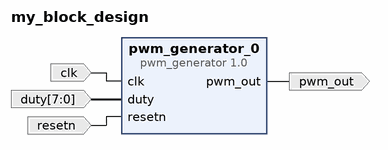
[diagram p0: block diagram of the top level]
# Vivado block design my_block_design, xc7a15tcsg324-2, Vivado 2022.2
create_bd_design my_block_design

create_bd_port -dir I -type clk clk
set_property -dict {CONFIG.FREQ_HZ 100000000} [get_bd_ports clk]
create_bd_port -dir I -type rst resetn
create_bd_port -dir I -from 7 -to 0 duty
create_bd_port -dir O pwm_out

create_bd_cell -type ip -vlnv gbs:example:pwm_generator:1.0 pwm_generator_0

# ---- connections ----

connect_bd_net [get_bd_ports clk] [get_bd_pins pwm_generator_0/clk]
connect_bd_net [get_bd_ports duty] [get_bd_pins pwm_generator_0/duty]
connect_bd_net [get_bd_pins pwm_generator_0/pwm_out] [get_bd_ports pwm_out]
connect_bd_net [get_bd_ports resetn] [get_bd_pins pwm_generator_0/resetn]

validate_bd_design
save_bd_design
